# Altium schematic sheet Sheet1.SchDoc
size A4
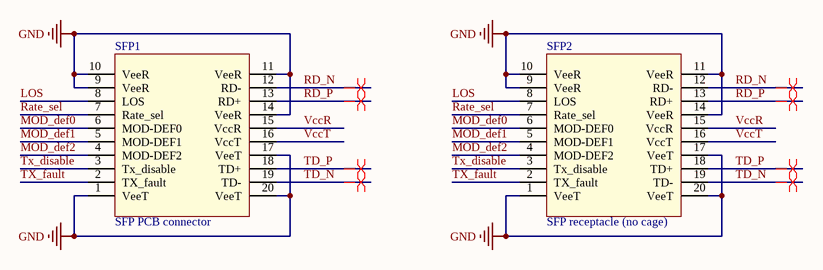
[diagram p0: Sheet1.SchDoc]

## Parts
SFP1  SFP PCB connector  [SFP pcb con solder]
SFP2  SFP receptacle (no cage)  [SFP receptacle (no cage)]

## Nets
GND: SFP1.1(VeeT) SFP1.9(VeeR) SFP1.10(VeeR) SFP1.11(VeeR) SFP1.14(VeeR) SFP1.17(VeeT) SFP1.20(VeeT) SFP2.1(VeeT) SFP2.9(VeeR) SFP2.10(VeeR) SFP2.11(VeeR) SFP2.14(VeeR) SFP2.17(VeeT) SFP2.20(VeeT)
LOS: SFP1.8(LOS) SFP2.8(LOS)
MOD_def0: SFP1.6(MOD-DEF0) SFP2.6(MOD-DEF0)
MOD_def1: SFP1.5(MOD-DEF1) SFP2.5(MOD-DEF1)
MOD_def2: SFP1.4(MOD-DEF2) SFP2.4(MOD-DEF2)
Rate_sel: SFP1.7(Rate_sel) SFP2.7(Rate_sel)
RD_N: SFP1.12(RD-) SFP2.12(RD-)
RD_P: SFP1.13(RD+) SFP2.13(RD+)
TD_N: SFP1.19(TD-) SFP2.19(TD-)
TD_P: SFP1.18(TD+) SFP2.18(TD+)
Tx_disable: SFP1.3(Tx_disable) SFP2.3(Tx_disable)
TX_fault: SFP1.2(TX_fault) SFP2.2(TX_fault)
VccR: SFP1.15(VccR) SFP2.15(VccR)
VccT: SFP1.16(VccT) SFP2.16(VccT)

## Layout directives
differential pair: RD_N, RD_P, TD_N, TD_P